# Altium schematic sheet ESP32.SchDoc
size A4; SheetNumber: 6; SheetTotal: 6
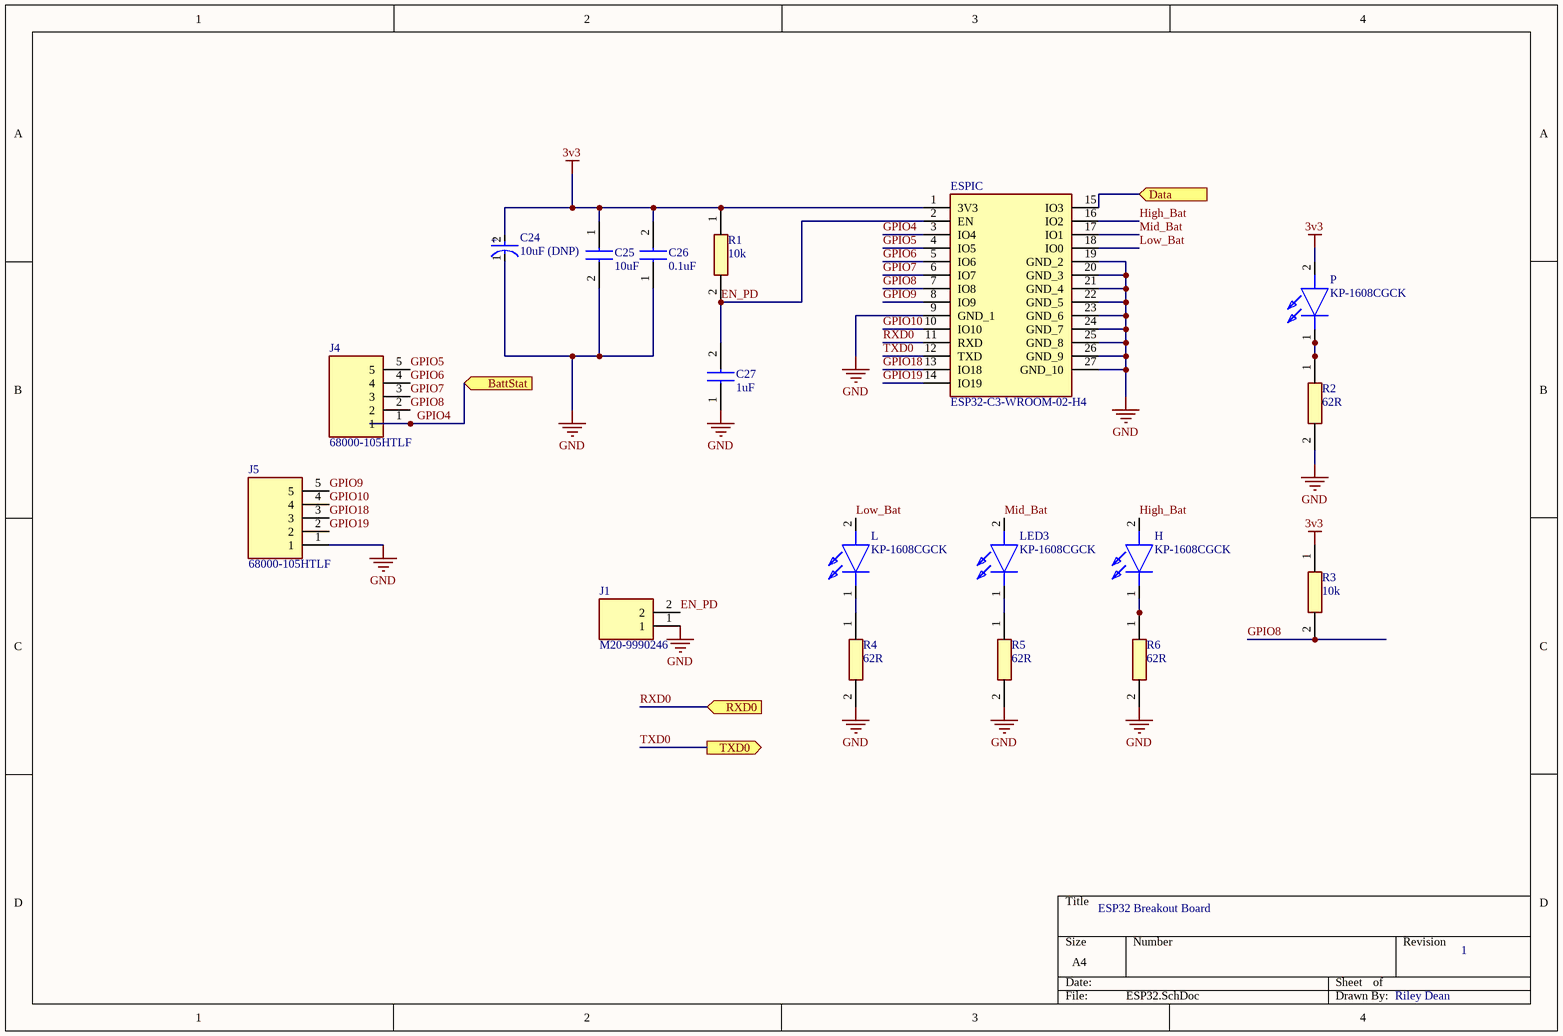
[diagram p0: ESP32.SchDoc]

## Parts
C24  10uF (DNP)  [FP-TAJS-MFG]
C25  10uF  [CAPC1608X90N]
C26  0.1uF  [CAPC3216X180N]
C27  1uF  [CAPC1608X90N]
ESPIC  ESP32-C3-WROOM-02-H4  [ESP32C3WROOM02H4]
H  KP-1608CGCK  [LEDC1608X120N]
J1  M20-9990246  [HDRV2W66P0X254_1X2_508X254X874P]
J4  68000-105HTLF  [HDRV5W67P0X254_1X5_1270X241X858P]
J5  68000-105HTLF  [HDRV5W67P0X254_1X5_1270X241X858P]
L  KP-1608CGCK  [LEDC1608X120N]
LED3  KP-1608CGCK  [LEDC1608X120N]
P  KP-1608CGCK  [LEDC1608X120N]
R1  10k  [RESC2012X60N]
R2  62R  [ERJH3]
R3  10k  [RESC2012X60N]
R4  62R  [ERJH3]
R5  62R  [ERJH3]
R6  62R  [ERJH3]

## Ports
BattStat (in), Data (in), RXD0 (in), TXD0 (out)

## Nets
3v3: C24.2(A) C25.1 C26.2 ESPIC.1(3V3) P.2(A) R1.1 R3.1
GND: C24.1(C) C25.2 C26.1 C27.1 ESPIC.9(GND_1) ESPIC.19(GND_2) ESPIC.20(GND_3) ESPIC.21(GND_4) ESPIC.22(GND_5) ESPIC.23(GND_6) ESPIC.24(GND_7) ESPIC.25(GND_8) ESPIC.26(GND_9) ESPIC.27(GND_10) J1.1 J5.1 R2.2 R4.2 R5.2 R6.2
Data: ESPIC.15(IO3) ; port Data
EN_PD: C27.2 ESPIC.2(EN) J1.2 R1.2
GPIO4: ESPIC.3(IO4) J4.1 ; port BattStat
GPIO5: ESPIC.4(IO5) J4.5
GPIO6: ESPIC.5(IO6) J4.4
GPIO7: ESPIC.6(IO7) J4.3
GPIO8: ESPIC.7(IO8) J4.2 R3.2
GPIO9: ESPIC.8(IO9) J5.5
GPIO10: ESPIC.10(IO10) J5.4
GPIO18: ESPIC.13(IO18) J5.3
GPIO19: ESPIC.14(IO19) J5.2
High_Bat: ESPIC.16(IO2) H.2(A)
Low_Bat: ESPIC.18(IO0) L.2(A)
Mid_Bat: ESPIC.17(IO1) LED3.2(A)
RXD0: ESPIC.11(RXD) ; port RXD0
TXD0: ESPIC.12(TXD) ; port TXD0
NetH_1: H.1(K) R6.1
NetL_1: L.1(K) R4.1
NetLED3_1: LED3.1(K) R5.1
NetP_1: P.1(K) R2.1

## Notes on the sheet
- ESP32 Breakout Board
- 1
- Riley Dean
- (in symbol CMP-04424-000459-1) +

## Library data of the parts
C24 = CMP-04424-000459-1: 10uF 2.5V  ±10% 8Ω 1206  SMD Tantalum Capacitor, TAJS106K002RNJ; Dissipation Factor: 6%; ESR (Equivalent Series Resistance): 8R; Lead Diameter: 1.2mm; Leakage Current: 500nA; Dielectric Material: Tantalum; Voltage Rating (DC): 2.5V; Weight: 0.000571oz; Tolerance: 10%; REACH SVHC: No SVHC; RoHS Compliant: Yes; Case Code (Metric): 3216; Min Operating Temperature: -55°C; Construction: Flat; Voltage Rating: 2.5V; Height: 1.2mm; Max Operating Temperature: 125°C; Case/Package: 1206; Packaging: Tape and Reel; Width: 1.6mm; Radiation Hardening: No; Mount: Surface Mount; Lead Free: Lead Free; Series: TAJ; Termination: SMD/SMT; Lead Pitch: 1.1mm; Depth: 1.6mm; Capacitance: 10uF; Length: 3.2mm; Number of Pins: 2; Voltage: 2.5V; Case Code (Imperial): 1206
C25 = CL10A106MQ8NNNC: Capacitor, CL10A106MQ8NNNC; Manufacturer_Name: Samsung Electro-Mechanics; Datasheet Link: http://uk.rs-online.com/web/p/products/7664718; Height: 0.9mm; Manufacturer_Part_Number: CL10A106MQ8NNNC; Mouser Part Number: 187-CL10A106MQ8NNNC; Mouser Price/Stock: https://www.mouser.co.uk/ProductDetail/Samsung-Electro-Mechanics/CL10A106MQ8NNNC?qs=349EhDEZ59qlB6a%2FjjeGAg%3D%3D; Arrow Part Number: CL10A106MQ8NNNC; Arrow Price/Stock: https://www.arrow.com/en/products/cl10a106mq8nnnc/samsung-electro-mechanics?region=nac
C26 = GCM31C5C1H104FA16L: Capacitor, GCM31C5C1H104FA16L, 1206; Manufacturer_Name: Murata Electronics; Datasheet Link: https://www.digikey.in/product-detail/en/murata-electronics/GCM31C5C1H104FA16L/490-GCM31C5C1H104FA16LCT-ND/11618925; Height: 1.8mm; Manufacturer_Part_Number: GCM31C5C1H104FA16L; Mouser Part Number: 81-GCM31C5C1H104FA16; Mouser Price/Stock: https://www.mouser.co.uk/ProductDetail/Murata-Electronics/GCM31C5C1H104FA16L?qs=rrS6PyfT74fke0d0BEF0PA%3D%3D; Arrow Part Number: GCM31C5C1H104FA16L; Arrow Price/Stock: https://www.arrow.com/en/products/gcm31c5c1h104fa16l/murata-manufacturing
C27 = 0603YC105JAT2A: Capacitor, 0603YC10JAT2A; Manufacturer_Name: AVX; Datasheet Link: http://www.mouser.com/catalog/supplier/library/pdf/AVXSurfaceMountCeramic.pdf; Height: 0.9mm; Manufacturer_Part_Number: 0603YC105JAT2A; Mouser Part Number: 581-0603YC105JAT2A; Mouser Price/Stock: https://www.mouser.co.uk/ProductDetail/AVX/0603YC105JAT2A/?qs=RCLU9o6%252BptxSjO%252BNXwzoBQ%3D%3D; Arrow Part Number: 0603YC105JAT2A; Arrow Price/Stock: https://www.arrow.com/en/products/0603yc105jat2a/avx
ESPIC = ESP32-C3-WROOM-02-H4: Integrated Circuit; Manufacturer_Name: Espressif Systems; Datasheet Link: https://www.mouser.in/datasheet/2/891/Espressif_Systems_04082021_ESP32_C3_WROOM_02-2295851.pdf; Height: 3.35mm; Manufacturer_Part_Number: ESP32-C3-WROOM-02-H4; Mouser Part Number: 356-ESP32C3WROOM02H4; Mouser Price/Stock: https://www.mouser.co.uk/ProductDetail/Espressif-Systems/ESP32-C3-WROOM-02-H4?qs=stqOd1AaK79%2FSA14oWtR%252Bw%3D%3D
H L LED3 P = KP-1608CGCK: LED; Manufacturer_Name: Kingbright; Datasheet Link: https://componentsearchengine.com/Datasheets/2/KP-1608CGCK.pdf; Height: 1.2mm; Manufacturer_Part_Number: KP-1608CGCK; Mouser Part Number: N/A; Mouser Price/Stock: https://www.mouser.co.uk/ProductDetail/Kingbright/KP-1608CGCK?qs=2JU0tDl2GZ3U0MYrqLedOQ%3D%3D; Arrow Part Number: KP-1608CGCK; Arrow Price/Stock: https://www.arrow.com/en/products/kp-1608cgck/kingbright?region=europe
J1 = M20-9990246: Connector; Manufacturer_Name: Harwin; Datasheet Link: https://cdn.harwin.com/pdfs/M20-999.pdf; Height: 8.74mm; Manufacturer_Part_Number: M20-9990246; Mouser Part Number: 855-M20-9990246; Mouser Price/Stock: https://www.mouser.co.uk/ProductDetail/Harwin/M20-9990246?qs=Jph8NoUxIfWjw4WmyRvzag%3D%3D
J4 J5 = 68000-105HTLF: Connector; Manufacturer_Name: Amphenol; Datasheet Link: https://www.arrow.com/en/products/68000-105htlf/amphenol-fci; Height: 8.58mm; Manufacturer_Part_Number: 68000-105HTLF; Mouser Part Number: 649-68000-105HTLF; Mouser Price/Stock: https://www.mouser.co.uk/ProductDetail/Amphenol-FCI/68000-105HTLF?qs=w%2Fv1CP2dgqrYgNyQVoiqDw%3D%3D; Arrow Part Number: 68000-105HTLF; Arrow Price/Stock: https://www.arrow.com/en/products/68000-105htlf/amphenol-fci
R1 R3 = RC0805FR-7W10KL: Resistor, RC0805FR-7W10KL, 10k; Manufacturer_Name: KEMET; Datasheet Link: https://datasheet.datasheetarchive.com/originals/distributors/Datasheets_SAMA/902f9e387b938f871d31120f5fc1d65e.pdf; Height: 0.6mm; Manufacturer_Part_Number: RC0805FR-7W10KL; Mouser Part Number: 603-RC0805FR-7W10KL; Mouser Price/Stock: https://www.mouser.co.uk/ProductDetail/YAGEO/RC0805FR-7W10KL?qs=tggtontpCXMsb%2F0we6O%252BLw%3D%3D
R2 R4-R6 = ERJ-H3EF62R0V: Resistor, ERJ-H3EF62R0V, 62ohms; Manufacturer_Name: Panasonic; Datasheet Link: http://industrial.panasonic.com/cdbs/www-data/pdf/RDQ0000/ast-ind-151033.pdf; Manufacturer_Part_Number: ERJ-H3EF62R0V